# Altium project Peltier_PID.PrjPcb
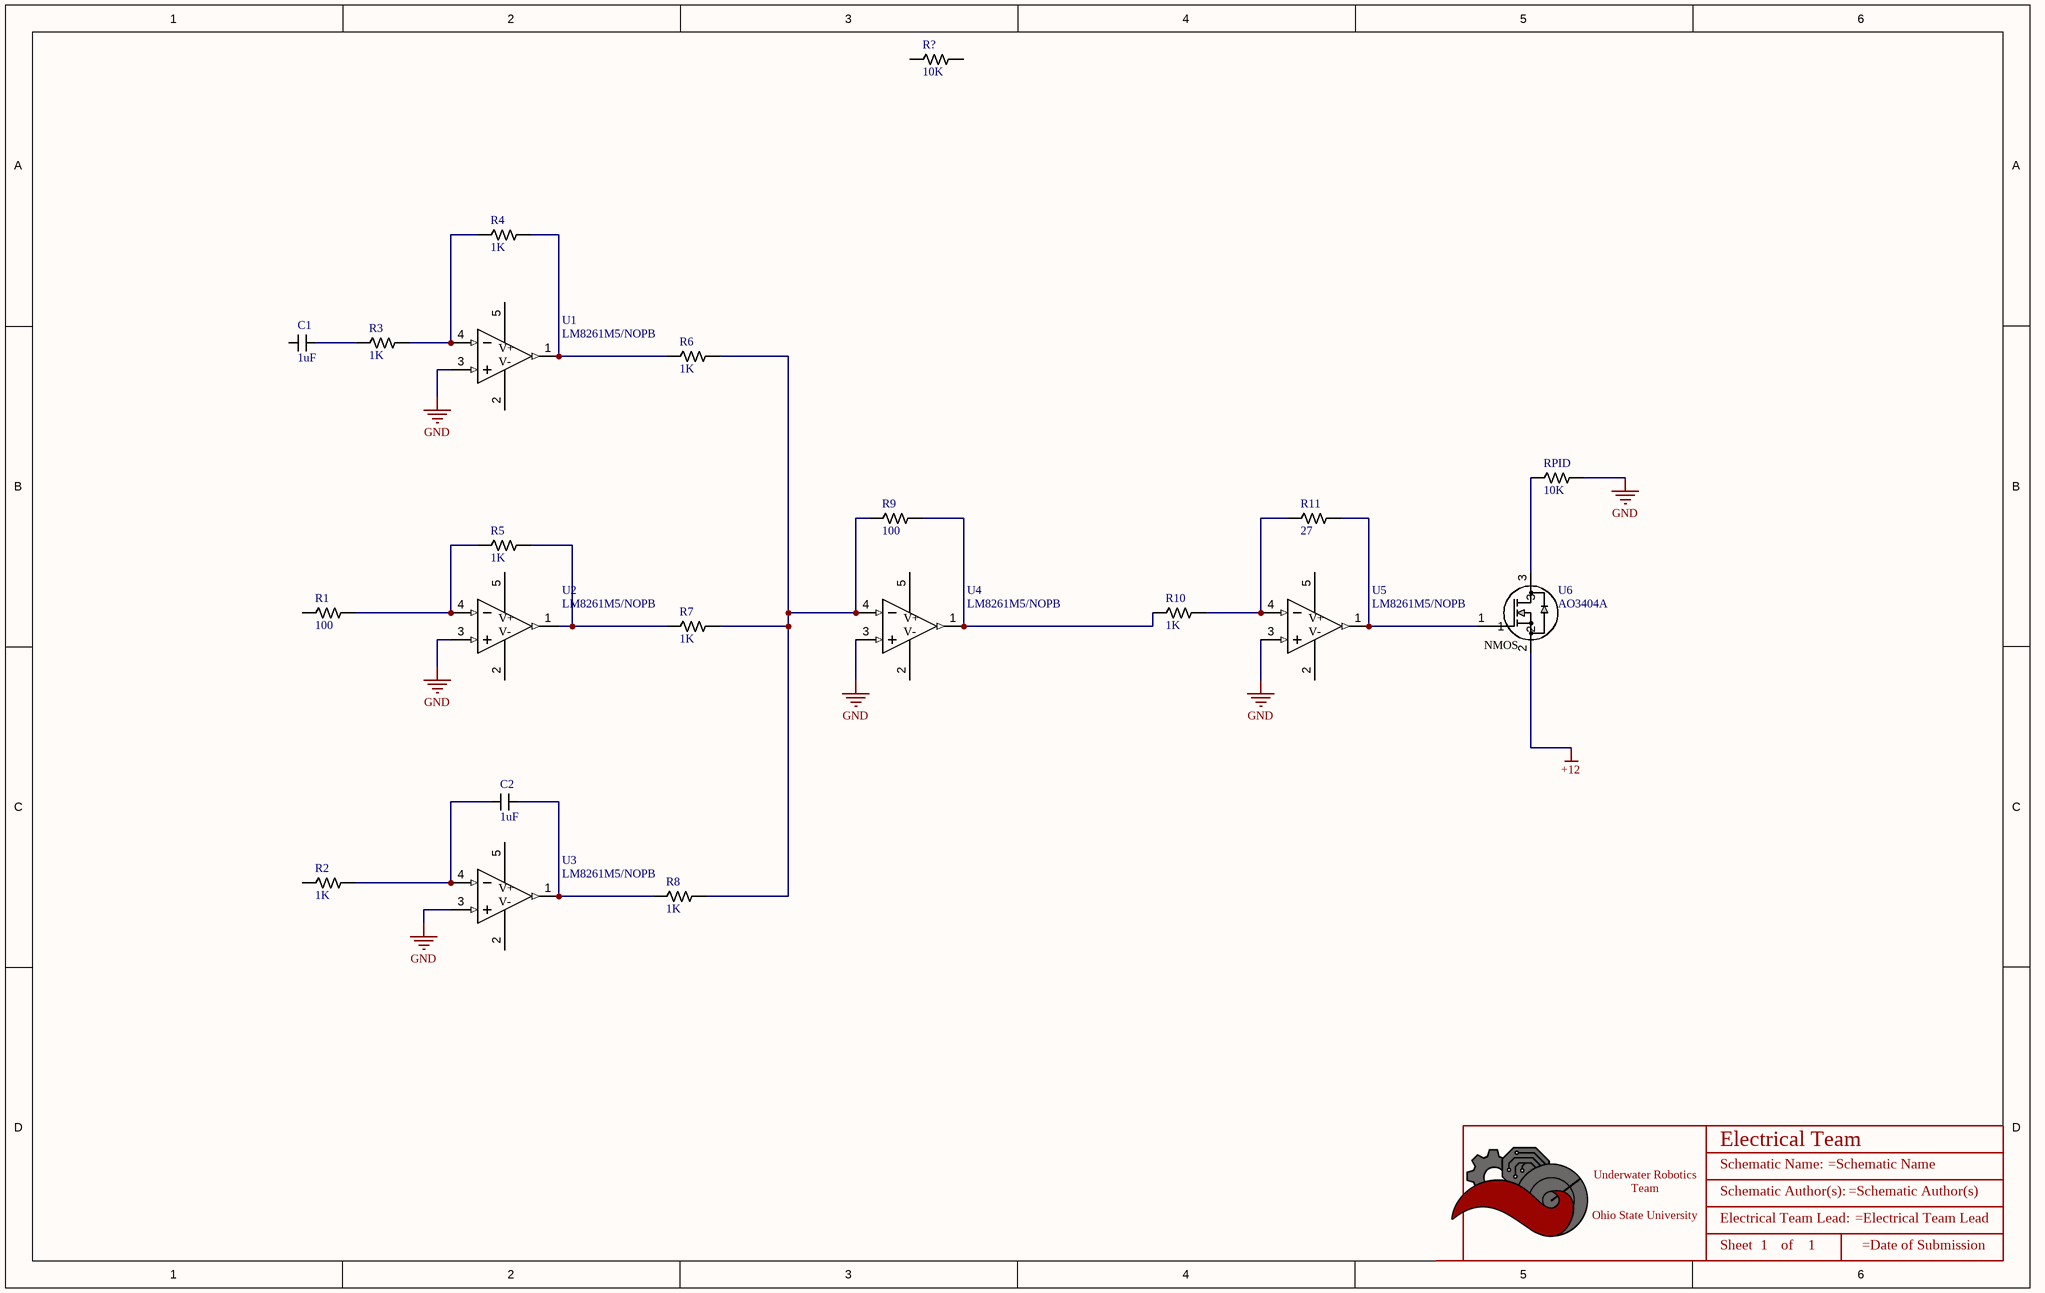
[diagram p0: PeltierPID_Schematic.SchDoc]
1 sheet, 22 parts. Net scope: global (net labels, ports and power ports of the same name join across sheets).
Board file: PeltierPID_PCB.PcbDoc

## Sheet PeltierPID_Schematic.SchDoc
size B; Organization: ORGANIZATION; Address1: ADDRESS 1; Address2: ADDRESS 2; Address3: ADDRESS 3; Address4: ADDRESS 4; Revision: -; SheetNumber: 1; SheetTotal: 1; ENG_APP_DATE: --/--/--; DSN_APP_DATE: --/--/--; CHK_APP_DATE: --/--/--; SPICEModelCacheFXLWQGKO: <root> / <DocumentId>FXLWQGKO</DocumentId> / <CacheFrame Number="0"> / <Model Name="lm8261/ns" Kind="ckt"> / <Text>.SUBCKT LM8261/NS 3 2 7 4 6 / V5 8 34 0.7E-3 / Q6 5 8 11 Q6M / R2 12 38 100.0E3 / D1 46 31 D1M / E1 16 0 17 0 1.0 / V6 31 12 0.75 / V7 34 51 4.0E-3 / R3 2 36 500.0 / R4 51 3 500.0 / M1 20 12 46 46 MWPM / I1 7 46 100.0E-6 / I2 41 4 50.0E-6 / I3 7 44 50.0E-6 / R5 29 27 500.0 / E2 38 16 43 9 1.0 / RE2 43 0 1.0E12 / V4 7 43 2.0 / R7 7 9 10.0E6 / R20 9 4 10.0E6 / Q7 26 36 37 Q6M / R14 7 26 300.0 / R15 7 5 300.0 / R6 29 33 500.0 / Q3 23 23 8 QQN / R18 37 42 500.0 / Q9 42 18 4 QQN / R19 11 42 500.0 / Q1 13 13 7 QQP / Q2 21 21 4 QQN / R16 28 4 300.0 / R17 45 4 300.0 / C4 19 6 8.0E-12 / R8 17 19 220.0 / R10 7 22 12.0 / Q4 36 36 23 QQN / R11 4 15 12.0 / Q5 8 8 49 QQN / R12 24 15 100.0 / I5 32 7 4.0E-6 / Q28 14 35 28 QQN / R13 25 22 100.0 / Q8 49 49 36 QQN / R9 46 30 1.0 / Q29 17 35 45 Q29M / Q30 50 20 4 QQN / Q31 20 20 4 QQN / Q32 6 50 15 Q32M / Q33 50 24 4 QQN / I6 4 35 4.0E-6 / Q34 44 44 21 QQN / I7 39 7 2.0E-6 / V10 7 40 1.4 / Q35 7 44 50 QQN / Q36 6 30 22 Q36M / Q37 12 25 7 QQP / Q38 41 41 13 QQP / Q40 50 41 46 QQP / Q41 14 32 26 QQP / Q42 17 32 5 Q42M / Q43 29 39 7 QQP / Q44 45 34 27 Q44M / Q45 28 36 33 Q45M / Q46 18 40 29 QQP / Q47 18 18 4 QQN / .MODEL QQN NPN / .MODEL QQP PNP / .MODEL Q44M PNP BF=85.0 / .MODEL Q45M PNP BF=85.0 / .MODEL Q6M NPN BF=200.0 / .MODEL Q29M NPN VAF=150.0 / .MODEL Q42M PNP VAF=150.0 / .MODEL Q32M NPN BF=600.0 VAF=125.0 / .MODEL Q36M PNP BF=165.0 VAF=100.0 / .MODEL MWPM PMOS KP=1.0E-3 VTO=-0.6 / .MODEL D1M D IS=7.0E-14 M=0.45 N=2 TT=6.0E-9 / .ENDS</Text> / </Model> / </CacheFrame> / </root>

### Parts
*  Title_Block  (value not drawn)  (graphical)
C1  value 1uF  [CAPACITOR_0603]  (hidden comment: 1uF Ceramic 16V)
C2  value 1uF  [CAPACITOR_0603]  (hidden comment: 1uF Ceramic 16V)
R1  Value  (Ohms): 100  [RESISTOR_0603]  (hidden comment: 100 Ohm 5% 1/8W)
R2  Value  (Ohms): 1K  [RESISTOR_0603]  (hidden comment: 1k Ohm 5% 1/8W)
R3  Value  (Ohms): 1K  [RESISTOR_0603]  (hidden comment: 1k Ohm 5% 1/8W)
R4  Value  (Ohms): 1K  [RESISTOR_0603]  (hidden comment: 1k Ohm 5% 1/8W)
R5  Value  (Ohms): 1K  [RESISTOR_0603]  (hidden comment: 1k Ohm 5% 1/8W)
R6  Value  (Ohms): 1K  [RESISTOR_0603]  (hidden comment: 1k Ohm 5% 1/8W)
R7  Value  (Ohms): 1K  [RESISTOR_0603]  (hidden comment: 1k Ohm 5% 1/8W)
R8  Value  (Ohms): 1K  [RESISTOR_0603]  (hidden comment: 1k Ohm 5% 1/8W)
R9  Value  (Ohms): 100  [RESISTOR_0603]  (hidden comment: 100 Ohm 5% 1/8W)
R10  Value  (Ohms): 1K  [RESISTOR_0603]  (hidden comment: 1k Ohm 5% 1/8W)
R11  Value  (Ohms): 27  [RESISTOR_0603]  (hidden comment: 27 Ohm 5% 1/8W)
R?  Value  (Ohms): 10K  [RESISTOR_0603]  (hidden comment: 10k Ohm 5% 1/10W)
RPID  Value  (Ohms): 10K  [RESISTOR_0603]  (hidden comment: 10k Ohm 5% 1/10W)
U1  LM8261M5/NOPB  [DBV0005A_N]
U2  LM8261M5/NOPB  [DBV0005A_N]
U3  LM8261M5/NOPB  [DBV0005A_N]
U4  LM8261M5/NOPB  [DBV0005A_N]
U5  LM8261M5/NOPB  [DBV0005A_N]
U6  AO3404A  [SOT-23_3L_ONS]

### Nets
+12: U6.2
GND: RPID.1 U1.3(IN+) U2.3(IN+) U3.3(IN+) U4.3(IN+) U5.3(IN+)
NetC1_1: C1.1 R3.2
NetC2_1: C2.1 R8.2 U3.1(OUT)
NetC2_2: C2.2 R2.1 U3.4(IN-)
NetR1_1: R1.1 R5.2 U2.4(IN-)
NetR3_1: R3.1 R4.2 U1.4(IN-)
NetR4_1: R4.1 R6.2 U1.1(OUT)
NetR5_1: R5.1 R7.2 U2.1(OUT)
NetR6_1: R6.1 R7.1 R8.1 R9.2 U4.4(IN-)
NetR9_1: R9.1 R10.2 U4.1(OUT)
NetR10_1: R10.1 R11.2 U5.4(IN-)
NetR11_1: R11.1 U5.1(OUT) U6.1
NetRPID_2: RPID.2 U6.3

Not connected (* = marked no-connect by the designer): C1 2; R1 2; R2 2; R? 1 2; U1 2(V-) 5(V+); U2 2(V-) 5(V+); U3 2(V-) 5(V+); U4 2(V-) 5(V+); U5 2(V-) 5(V+)

### Notes on the sheet
- DWG. NO.
- REV.
- SHT.
- THIS DOCUMENT AND THE DATA DISCLOSED HEREIN OR HEREWITH IS THE PROPERTY OF ALTIUM LIMITED AND MAY BE FREELY DISTRIBUTED IN WHOLE. NO RIGHTS ARE RESERVED OR EXPRESS OR IMPLIED WARANTEE GIVEN.
- REVISION
- DESCRIPTION
- DATE
- APPROVED
- ENG:
- APPROVALS
- PROJECT
- DSN:
- CHK:
- REFERENCE DOCUMENTS
- PROJECT REVISION:
- TITLE
- DOCUMENT REVISION:
- DESIGN ITEM:
- BOM:
- FAB DWG:
- PCB DWG:
- ASSY DWG:
- SCALE:
- SIZE
- B
- CAGE CODE
- FILE NAME
- DWG NO.
- SHEET
- OF
- REV
- (in symbol AO3404A) NMOS
- (in symbol Title_Block) Electrical Team; Schematic Name:; Schematic Author(s):; Underwater Robotics Team / Ohio State University; Electrical Team Lead:; Sheet; of

### Library data of the parts
* = Title_Block: UWRT Schematic Title Block Template / Created June 2021, Dylan Trainor
C1 C2 = CAPACITOR_1uF_0603: Cap 1uF 16V +/-10% / Ceramic 0603; Made By: Flip B; Tolerance: +/- 10%; Voltage: 16V; Supplier 1: Digi-Key; Supplier Part Number 1: 399-7847-1-ND
R1 R9 = RESISTOR_100_0603: RES 100 OHM 5% 1/8W 0603; Tolerance: +/- 5%; Made By: Flip B; Value: 100; ComponentLink1Description: Digikey; ComponentLink1URL: https://www.digikey.com/en/products/detail/koa-speer-electronics-inc/RK73B1JTTD101J/9844701; Supplier 1: Digi-Key; Supplier Part Number 1: 2019-RK73B1JTTD101JCT-ND; Wattage: 1/8W
R2-R8 R10 = RESISTOR_1K_0603: RES 1k OHM 5% 1/8W 0603; Tolerance: +/- 5%; Made By: Robert Pafford; ComponentLink1Description: Datasheet; ComponentLink1URL: https://www.bourns.com/docs/product-datasheets/CRxxxxx.pdf; Wattage: 1/8W; Supplier: Digikey; Digikey Part Numer: CR0603-JW-104ELFTR-ND; Supplier 1: Digi-Key; Supplier Part Number 1: 2019-RK73B1JTTD102JCT-ND; Value: 1K
R11 = RESISTOR_27_0603: RES 27 OHM 5% 1/8W 0603; Tolerance: +/- 5%; Made By: Robert Pafford; Value: 1K; ComponentLink1Description: Datasheet; ComponentLink1URL: https://www.bourns.com/docs/product-datasheets/CRxxxxx.pdf; Wattage: 1/8W; Supplier: Digikey; Digikey Part Numer: CR0603-JW-104ELFTR-ND; Supplier 1: Digi-Key; Supplier Part Number 1: 2019-RK73B1JTTD270JCT-ND
R? RPID = RESISTOR_10K_0603: RES 10k OHM 5% 1/10W 0603; Tolerance: +/- 5%; Wattage: 1/8W; Made By: Robert Pafford; Value: 1K; ComponentLink1Description: Datasheet; ComponentLink1URL: https://www.bourns.com/docs/product-datasheets/CRxxxxx.pdf; Supplier: Digikey; Digikey Part Numer: CR0603-JW-104ELFTR-ND; Supplier 1: Digi-Key; Supplier Part Number 1: 2019-RK73B1JTTD103JCT-ND
U1-U5 = LM8261M5/NOPB: IC OPAMP GP 1 CIRCUIT SOT23-5; PartNumber: LM8261M5X/NOPB; Manufacturer: Texas Instruments; Supply Current: 1.3 mA; Supply Voltage: 2.5 V ~ 30 V, +/- 1.25 V ~ 15 V; Gain Bandwidth Product: 21 MHz; Created By: Dylan T; Supplier 1: Digi-Key; Supplier Part Number 1: LM8261M5/NOPBCT-ND
U6 = AO3404A: N-Channel 30 V 5.8A (Ta) 1.4W (Ta) Surface Mount SOT-23-3; Vendor: Alpha & Omega Semiconductor Inc.; SourceLibrary: ON_Semiconductor_2020-01-13; Vgs (Max): 3V @ 5.8A, 10V; Vgs (th): 3V @ 250µA; Vdss: 30V; Rds (on): 28mOhm @ 5.8A, 10V; Amp Rating: 5.8 A; FET Type: N-Channel; Package: SOT23-3L; Manufacturer _Part_Number: AO3404A; Power Dissipation: 1.4W (Ta); Supplier 1: Digi-Key; Supplier Part Number 1: 785-1004-1-ND; Created By: Dylan T